# EasyEDA schematic 1-Schematic_Magnetic Levitation.json

## Sheets
1 Bottom PCB: TITLE: Bottom PCB; REV: 1.0; Date: 2024-03-29; Sheet: 1/1; Drawn By: tecknet; Company: Tecknet
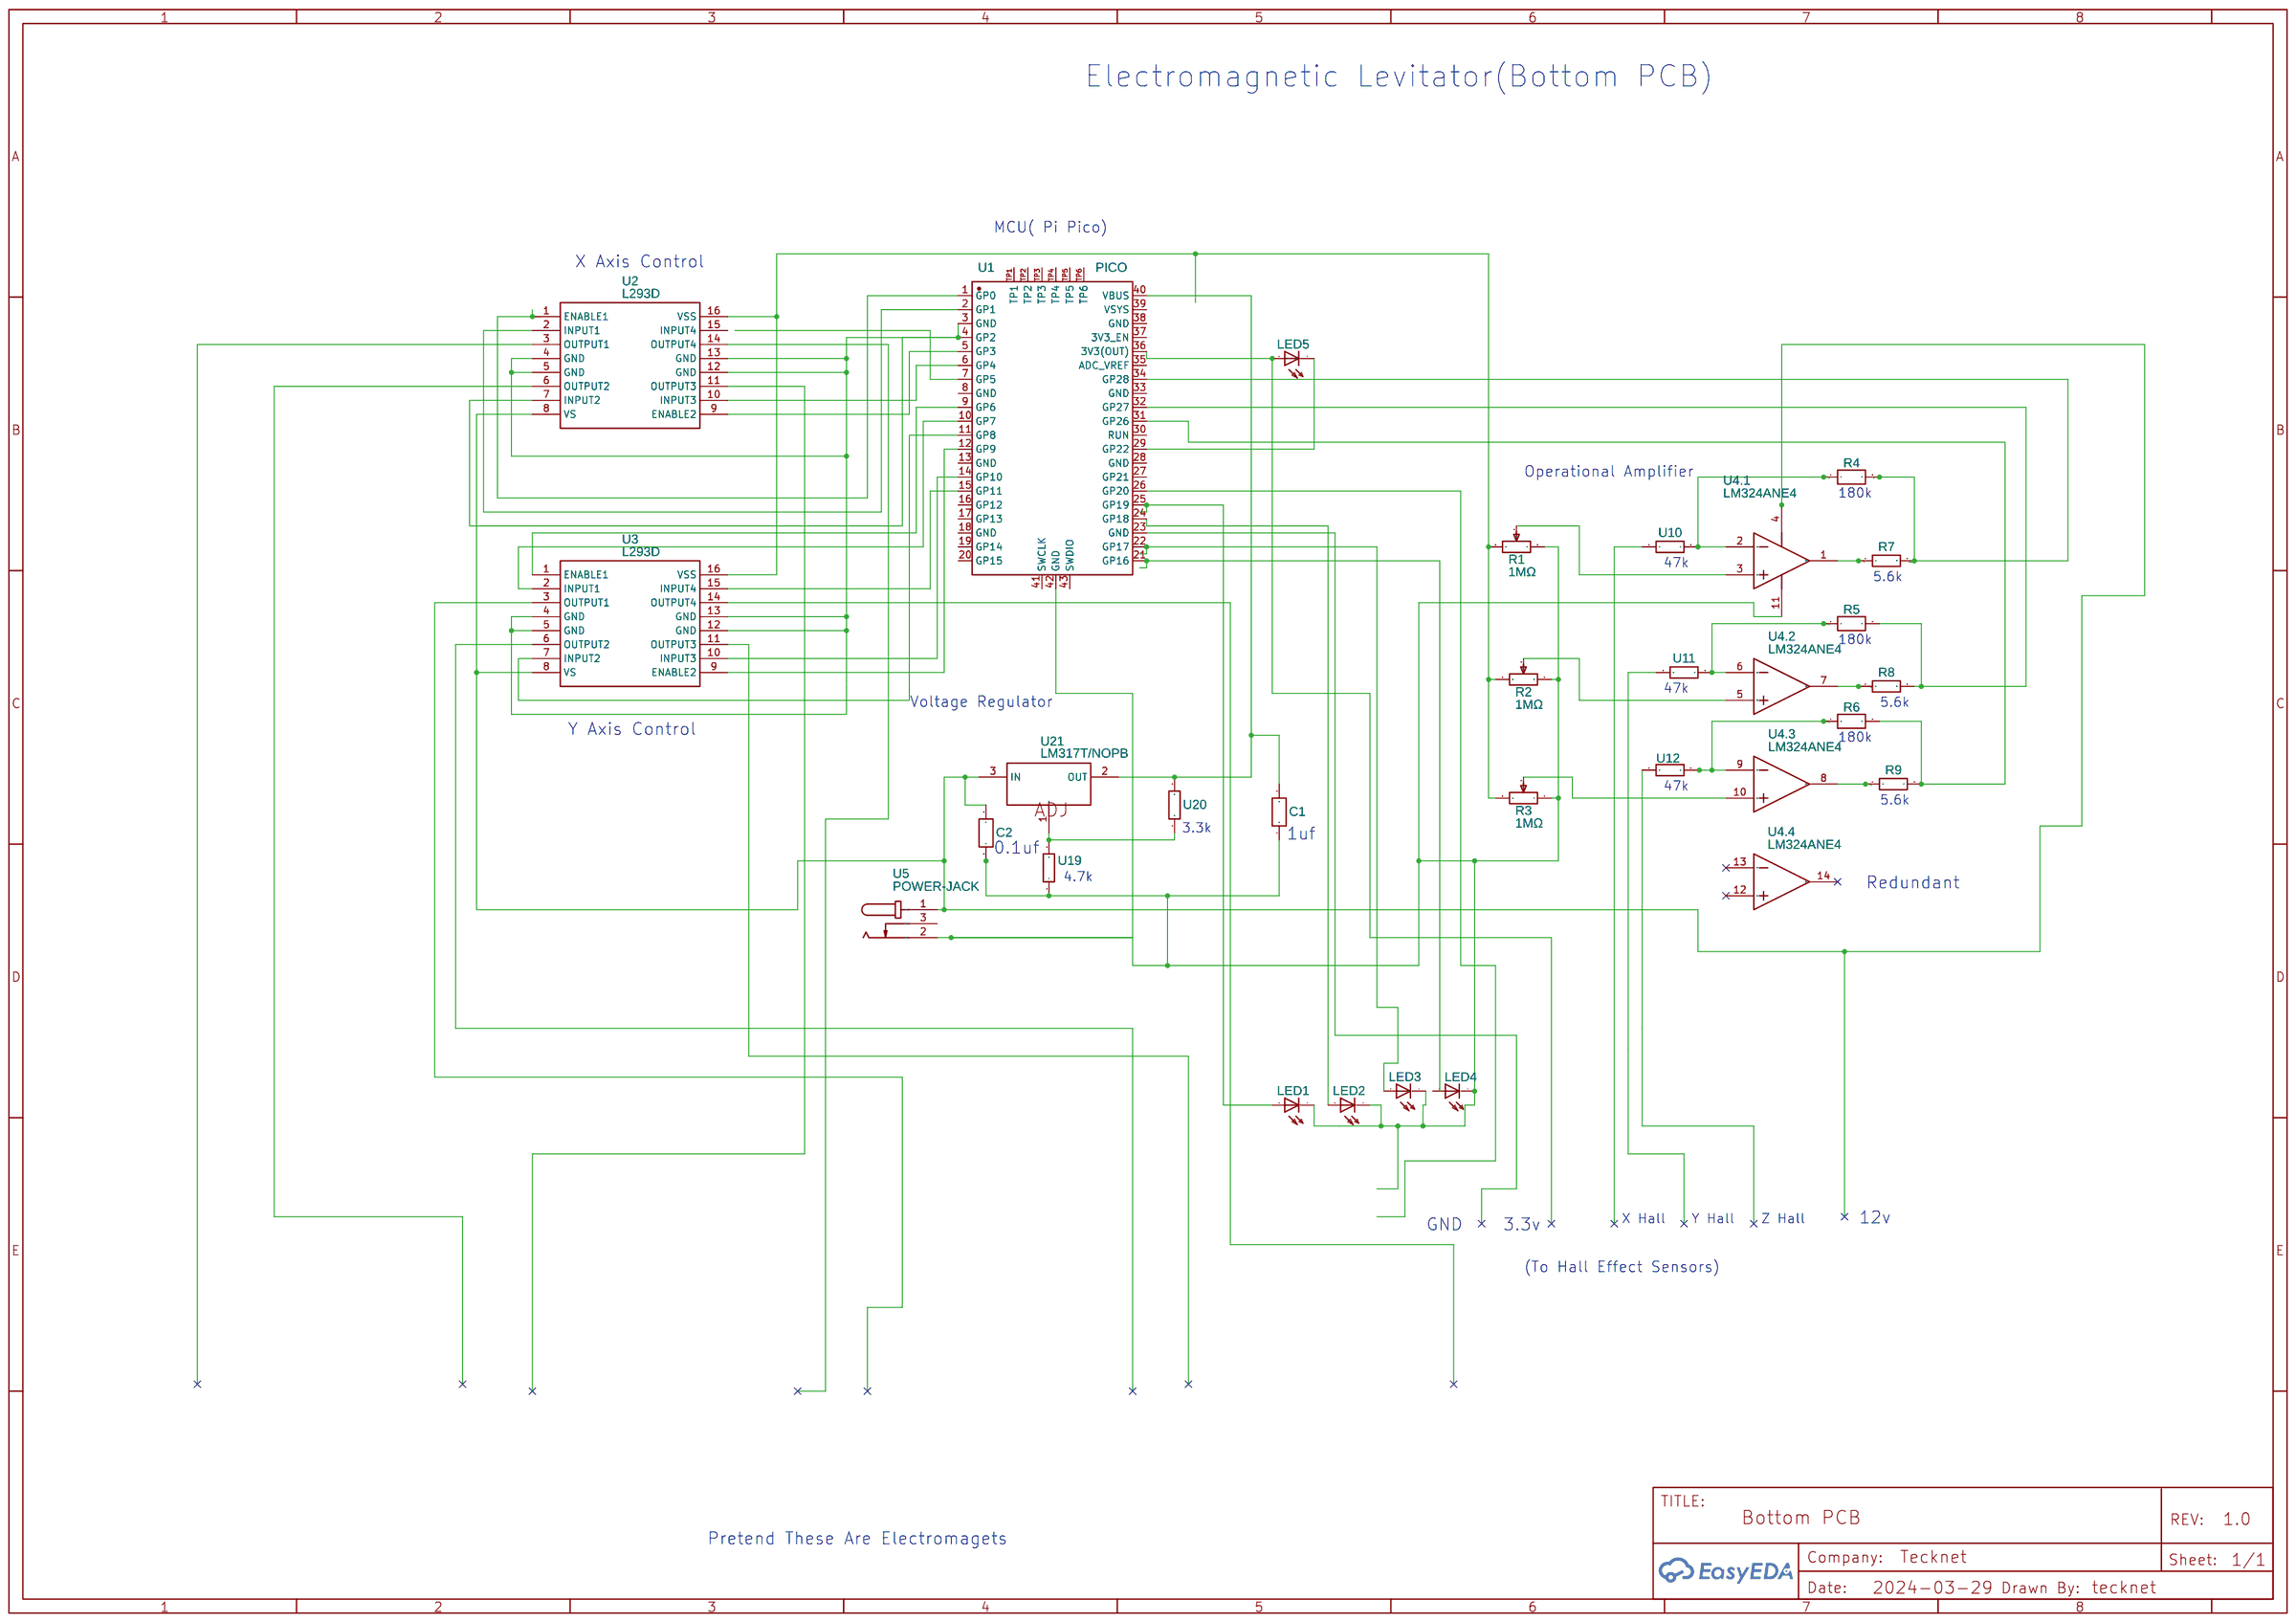
[diagram p0: Bottom PCB]
2 Sensor Module: TITLE: Sensor Module; Date: 2024-03-30; Drawn By: Tecknet
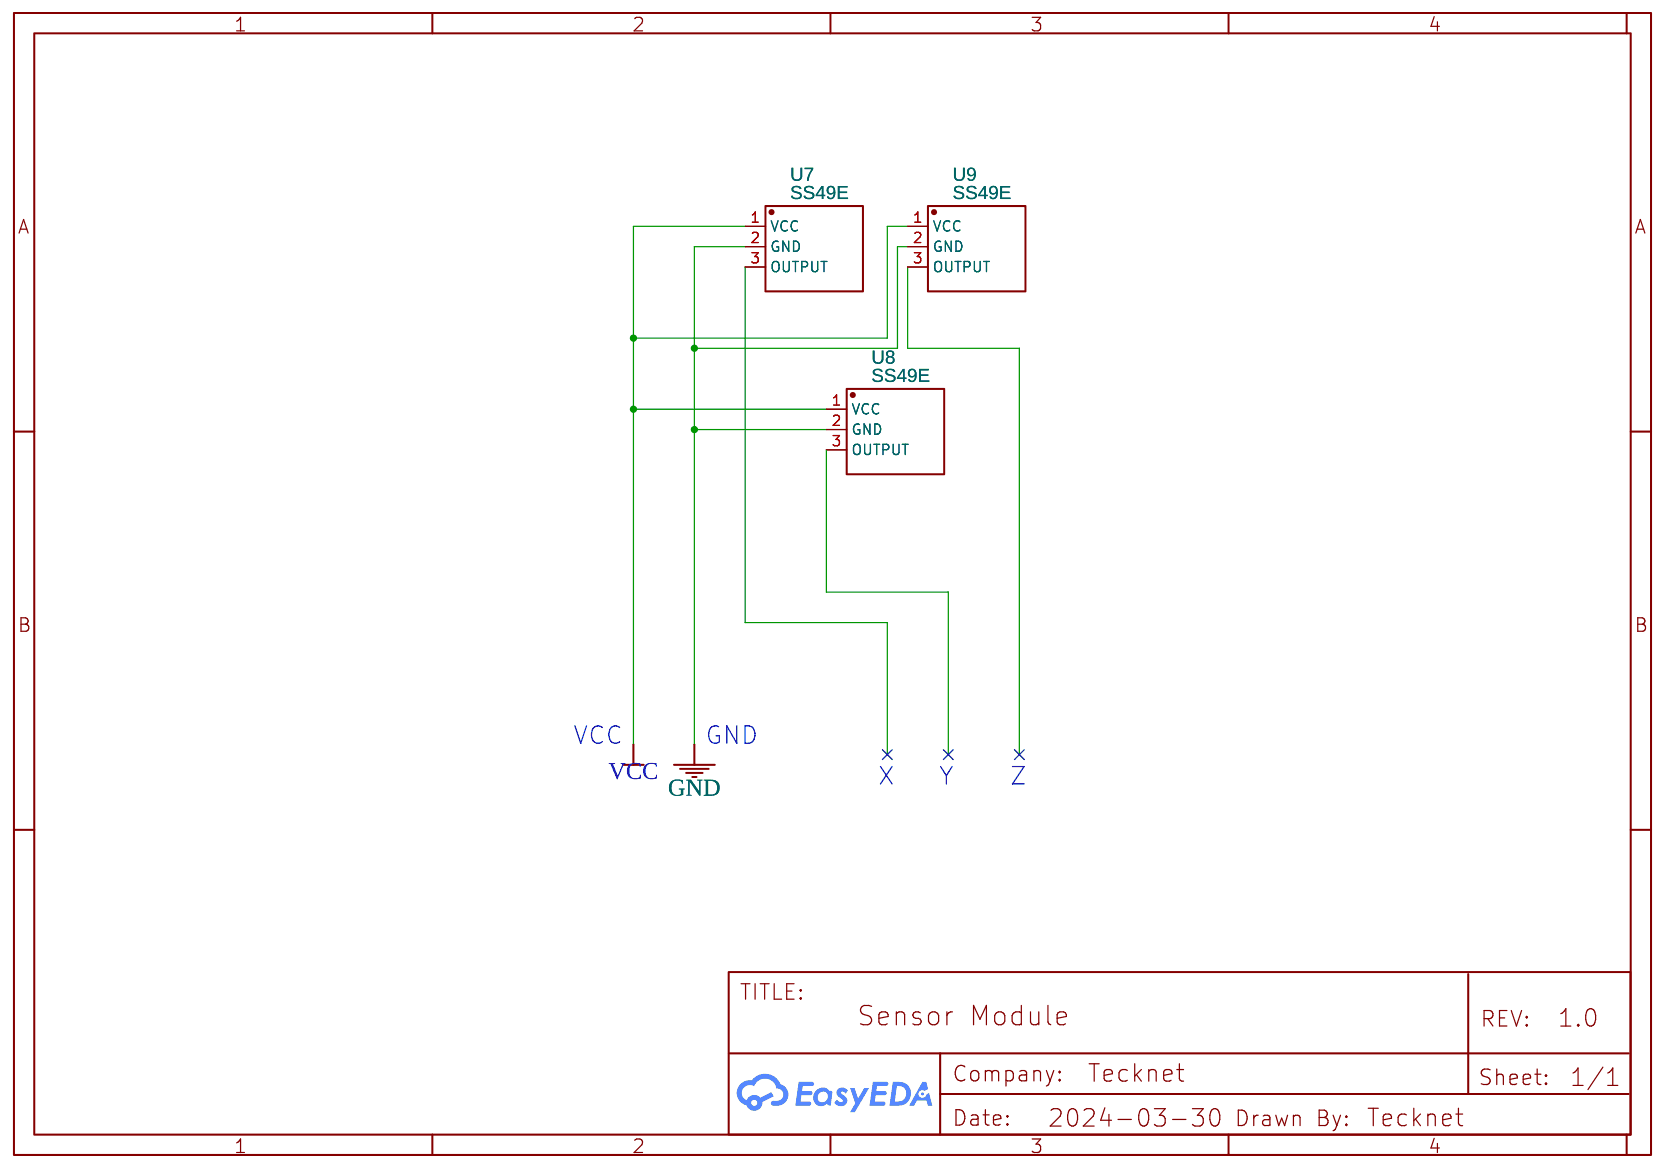
[diagram p1: Sensor Module]

## Parts
sheet Bottom PCB
C1  330Ω  [R0402]
C2  330Ω  [R0402]
LED1  LED  [LED_LED3MM]
LED2  LED  [LED_LED3MM]
LED3  LED  [LED_LED3MM]
LED4  LED  [LED_LED3MM]
LED5  LED  [LED_LED3MM]
R1  1MΩ  [RES-ADJ-TH_3P-L9.5-W9.5-P2.50-L_3386P]
R2  1MΩ  [RES-ADJ-TH_3P-L9.5-W9.5-P2.50-L_3386P]
R3  1MΩ  [RES-ADJ-TH_3P-L9.5-W9.5-P2.50-L_3386P]
R4  0603_C9900021178  [R0603]
R5  0603_C9900021178  [R0603]
R6  0603_C9900021178  [R0603]
R7  0805_C9900012714  [R0805]
R8  0805_C9900012714  [R0805]
R9  0805_C9900012714  [R0805]
U1  PICO  [COMM-SMD_L51.0-W21.0-P2.54_SC0916]
U2  L293D  [DIP-16_L20.0-W6.4-P2.54-LS7.6-BL]
U3  L293D  [DIP-16_L20.0-W6.4-P2.54-LS7.6-BL]
U4  LM324ANE4  [PDIP-14_L19.6-W6.5-P2.54-LS7.9-BL]  (sections 1,2,3,4)
U5  POWER-JACK  [DC-IN-TH_POWER-JACK]
U10  4703-1206  [R1206]
U11  4703-1206  [R1206]
U12  4703-1206  [R1206]
U19  4703-1206  [R1206]
U20  4703-1206  [R1206]
U21  LM317T/NOPB  [TO-220-3_L10.2-W4.6-P2.54-L]
sheet Sensor Module
U7  SS49E  [TO-92S_3P-L4.1-W1.6-P1.27-L]
U8  SS49E  [TO-92S_3P-L4.1-W1.6-P1.27-L]
U9  SS49E  [TO-92S_3P-L4.1-W1.6-P1.27-L]

## Library data of the parts
C1 C2 = 0402 ±5% 330Ω: Contributor: lcsc; Supplier: LCSC; Supplier Part: C2889360; Manufacturer: VO(翔胜); JLCPCB Part Class: Extended Part
LED1-LED5 = LED: Contributor: nadirsf123
R1-R3 = 3386P-1-105_C118946: Resistance(Ohms): 1M; Contributor: LCSC; Supplier: LCSC; Supplier Part: C118946; Manufacturer: BOCHEN(博晨); Manufacturer Part: 3386P-1-105; JLCPCB Part Class: Extended Part
R4-R6 = 0603_C9900021178: Contributor: lcsc; Supplier: LCSC; Supplier Part: C9900021178; Manufacturer: null; Manufacturer Part: 0603; JLCPCB Part Class: Extended Part
R7-R9 = 0805_C9900012714: Contributor: LCSC; Supplier: LCSC; Supplier Part: C9900012714; Manufacturer: null; Manufacturer Part: 0805; JLCPCB Part Class: Extended Part
U1 = PICO: Supplier: LCSC; Supplier Part: C7203002; Manufacturer: Raspberry Pi(树莓派); JLCPCB Part Class: Extended Part; Contributor: lcsc
U2 U3 = L293D: Contributor: pitreluc; Supplier: LCSC; Manufacturer: ST(意法半导体); Supplier Part: C12340; JLCPCB Part Class: Extended Part
U4 = LM324ANE4: subpart_no: 1; Supplier: LCSC; Supplier Part: C4369463; Manufacturer: TI(德州仪器)
U5 = POWER-JACK: Contributor: LCSC; Supplier: LCSC; Supplier Part: C9900001795; Manufacturer: 索峰; JLCPCB Part Class: Extended Part
U10-U12 U19 U20 = 4703-1206: Contributor: lcsc; Supplier: LCSC; Supplier Part: C9900013564; Manufacturer: null; JLCPCB Part Class: Extended Part
U21 = LM317T/NOPB: Contributor: LCSC; Supplier: LCSC; Supplier Part: C2870516; Manufacturer: TI(德州仪器)
U7-U9 = SS49E: Contributor: LCSC; Supplier: LCSC; Manufacturer: Honeywell(霍尼韦尔); Supplier Part: C85697; JLCPCB Part Class: Extended Part

## Nets
GND: U7.2(GND) U8.2(GND) U9.2(GND)
VCC: U7.1(VCC) U8.1(VCC) U9.1(VCC)
Net-(C1-1): C1.1 C2.1 LED1.- LED2.- LED3.- LED4.- R1.1 R2.1 R3.1 U1.42(GND) U4.11(GND) U5.2 U19.1
Net-(C1-2): C1.2 U1.40(VBUS) U20.2 U21.2(OUT)
Net-(C2-2): C2.2 U2.8(VS) U3.8(VS) U4.4(VCC) U5.1 U21.3(IN)
Net-(LED1-+): LED1.+ U1.25(GP19)
Net-(LED2-+): LED2.+ U1.24(GP18)
Net-(LED3-+): LED3.+ U1.22(GP17)
Net-(LED4-+): LED4.+ U1.21(GP16)
Net-(LED5-+): LED5.+ U1.36(3V3(OUT))
Net-(LED5--): LED5.- U1.29(GP22)
Net-(R1-2): R1.2 U4.3(IN1+)
Net-(R1-3): R1.3 R2.3 R3.3 U2.16(VSS) U3.16(VSS)
Net-(R2-2): R2.2 U4.5(IN2+)
Net-(R3-2): R3.2 U4.10(IN3+)
Net-(R4-1): R4.1 U4.2(IN1-) U10.2
Net-(R4-2): R4.2 R7.2 U1.34(GP28)
Net-(R5-1): R5.1 U4.6(IN2-) U11.2
Net-(R5-2): R5.2 R8.2 U1.32(GP27)
Net-(R6-1): R6.1 U4.9(IN3-) U12.2
Net-(R6-2): R6.2 R9.2 U1.31(GP26)
Net-(R7-1): R7.1 U4.1(OUT1)
Net-(R8-1): R8.1 U4.7(OUT2)
Net-(R9-1): R9.1 U4.8(OUT3)
Net-(U1-1): U1.1(GP0) U2.1(ENABLE1)
Net-(U1-2): U1.2(GP1) U2.2(INPUT1)
Net-(U1-3): U1.3(GND) U1.4(GP2) U2.4(GND) U2.5(GND) U2.7(INPUT2) U2.12(GND) U2.13(GND) U3.4(GND) U3.5(GND) U3.12(GND) U3.13(GND)
Net-(U1-5): U1.5(GP3) U2.9(ENABLE2)
Net-(U1-6): U1.6(GP4) U2.10(INPUT3)
Net-(U1-9): U1.9(GP6) U3.1(ENABLE1)
Net-(U1-10): U1.10(GP7) U3.2(INPUT1)
Net-(U1-11): U1.11(GP8) U3.7(INPUT2)
Net-(U1-12): U1.12(GP9) U3.9(ENABLE2)
Net-(U1-14): U1.14(GP10) U3.10(INPUT3)
Net-(U1-15): U1.15(GP11) U3.15(INPUT4)
Net-(U19-2): U19.2 U20.1 U21.1(ADJ)

Not connected (* = marked no-connect by the designer): U1 7(GP5) 8(GND) 13(GND) 16(GP12) 17(GP13) 18(GND) 19(GP14) 20(GP15) 23(GND) 26(GP20) 27(GP21) 28(GND) 30(RUN) 33(GND) 35(ADC_VREF) 37(3V3_EN) 38(GND) 39(VSYS) 41(SWCLK) 43(SWDIO) TP1 TP2 TP3 TP4 TP5 TP6; U2 3(OUTPUT1) 6(OUTPUT2) 11(OUTPUT3) 14(OUTPUT4) 15(INPUT4); U3 3(OUTPUT1) 6(OUTPUT2) 11(OUTPUT3) 14(OUTPUT4); U4 12(IN4+)* 13(IN4-)* 14(OUT4)*; U5 3; U7 3(OUTPUT); U8 3(OUTPUT); U9 3(OUTPUT); U10 1; U11 1; U12 1

## Notes on the sheets
sheet 1
- Electromagnetic Levitator(Bottom PCB)
- MCU( Pi Pico)
- X Axis Control
- Operational Amplifier
- 180k
- 47k
- 5.6k
- 180k
- 47k
- Voltage Regulator
- 5.6k
- Y Axis Control
- 180k
- 47k
- 5.6k
- 3.3k
- 0.1uf
- 1uf
- 4.7k
- Redundant
- GND
- 3.3v
- X Hall
- Y Hall
- Z Hall
- 12v
- (To Hall Effect Sensors)
- Pretend These Are Electromagets
sheet 2
- VCC
- GND
- X
- Y
- Z
